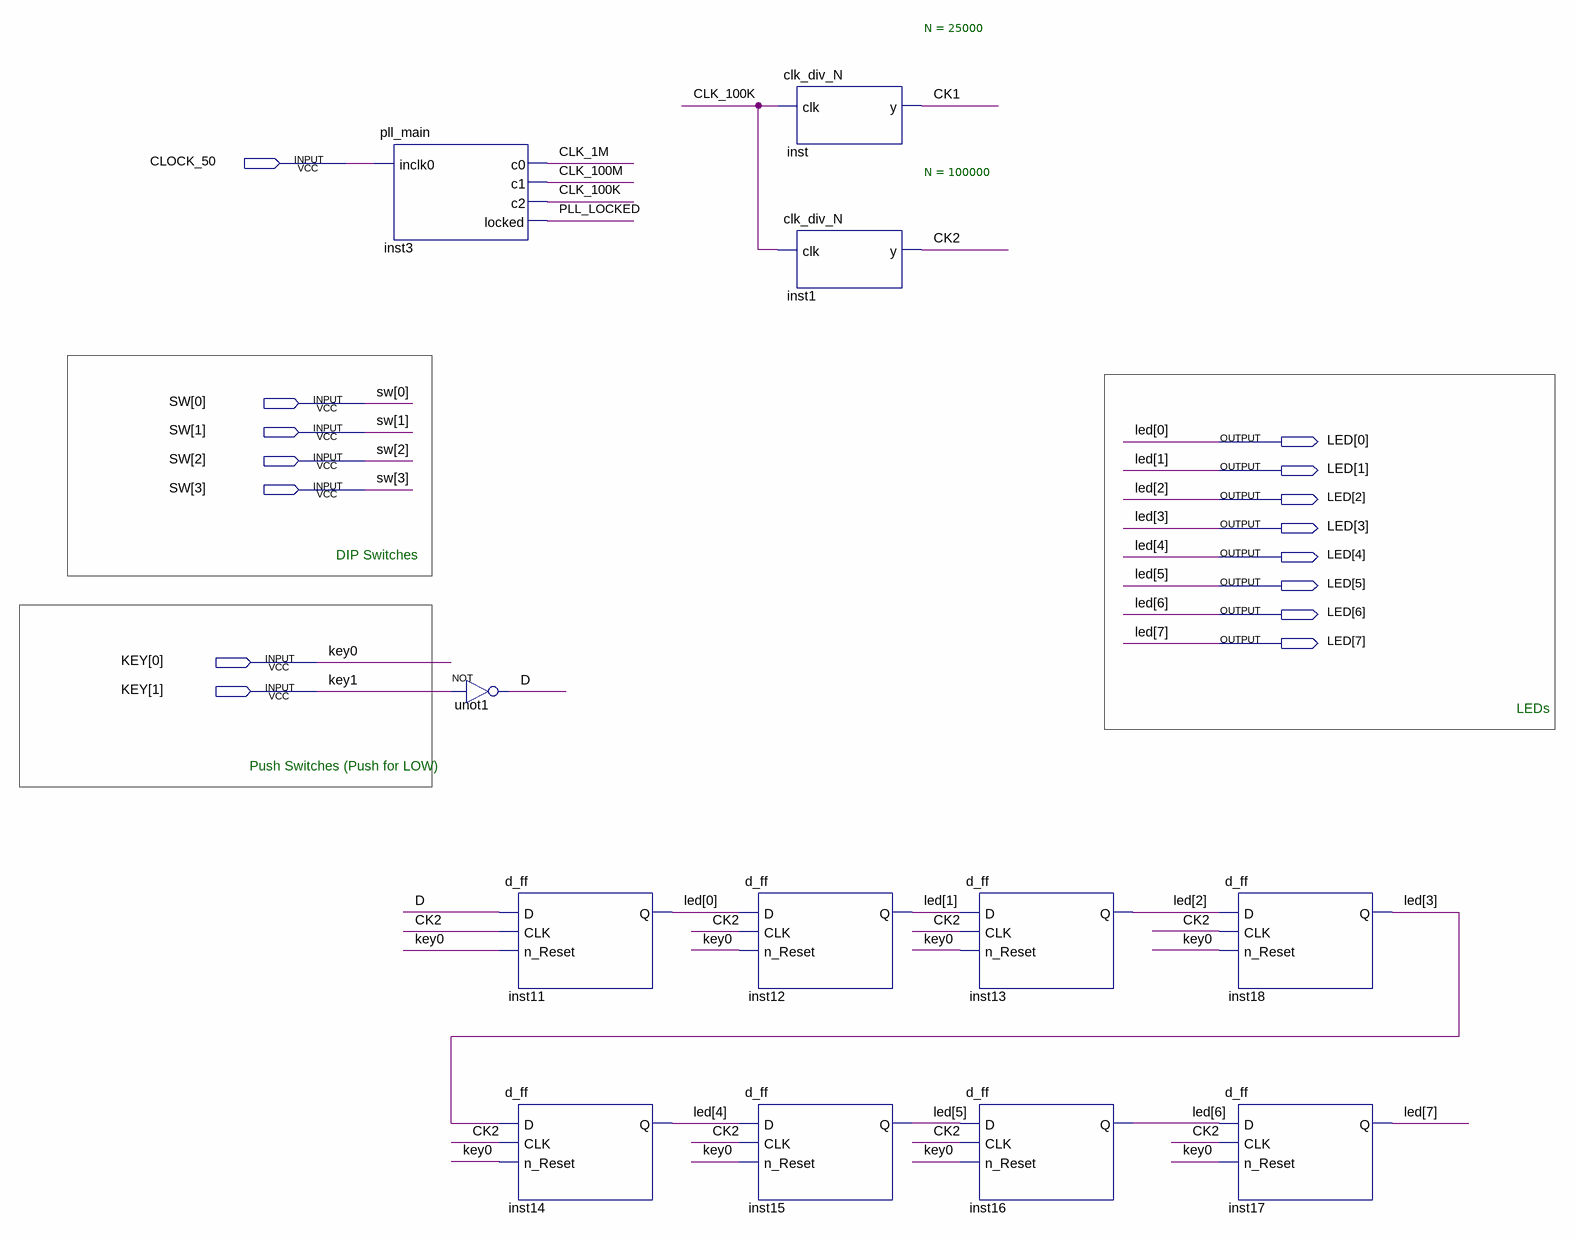
[diagram p0: schematic sheet]
// Quartus schematic TopLevelSchematic.bdf as structural Verilog: 12 symbols, 15 pins
module TopLevelSchematic (
  input  CLOCK_50,
  input  [3:0] SW,
  input  [1:0] KEY,
  output [7:0] LED
);

  wire CK1, CK2, CLK_1M, CLK_100K, CLK_100M, D, PLL_LOCKED;

  pll_main inst3 (.inclk0(CLOCK_50), .c0(CLK_1M), .c1(CLK_100M), .c2(CLK_100K), .locked(PLL_LOCKED));
  not unot1 (D, KEY[1]);
  d_ff inst11 (.D(D), .CLK(CK2), .n_Reset(KEY[0]), .Q(LED[0]));
  d_ff inst14 (.D(LED[3]), .CLK(CK2), .n_Reset(KEY[0]), .Q(LED[4]));
  d_ff inst12 (.D(LED[0]), .CLK(CK2), .n_Reset(KEY[0]), .Q(LED[1]));
  d_ff inst15 (.D(LED[4]), .CLK(CK2), .n_Reset(KEY[0]), .Q(LED[5]));
  clk_div_N #(.N(25000)) inst (.clk(CLK_100K), .y(CK1));
  clk_div_N #(.N(100000)) inst1 (.clk(CLK_100K), .y(CK2));
  d_ff inst13 (.D(LED[1]), .CLK(CK2), .n_Reset(KEY[0]), .Q(LED[2]));
  d_ff inst16 (.D(LED[5]), .CLK(CK2), .n_Reset(KEY[0]), .Q(LED[6]));
  d_ff inst18 (.D(LED[2]), .CLK(CK2), .n_Reset(KEY[0]), .Q(LED[3]));
  d_ff inst17 (.D(LED[6]), .CLK(CK2), .n_Reset(KEY[0]), .Q(LED[7]));

  // Notes on the sheet:
  //   DIP Switches
  //   LEDs
  //   Push Switches (Push for LOW)
endmodule
